# Altium schematic sheet [2] ADC.SchDoc: ADC
size 393 x 281 mm; SheetNumber: 2; SheetTotal: 21; PageSetup: Record=PageOptions|CenterHorizontal=True|CenterVertical=True|PrintScale=0.94|XCorrection=0.00|YCorrection=0.00|PrintKind=0|BorderSize=5000000|LeftOffset=0|BottomOffset=0|Orientation=2|PaperLength=1000|PaperWidth=1000|Scale=100|PaperSource=15|PrintQuality=600|MediaType=1|DitherType=10|PrintScaleMode=1|PaperKind=A4; Adr1: August Barks gata 6B; Adr2: SE-421 32 Västra Frölunda; Adr3: Sweden; Webpage: www.omnisys.se
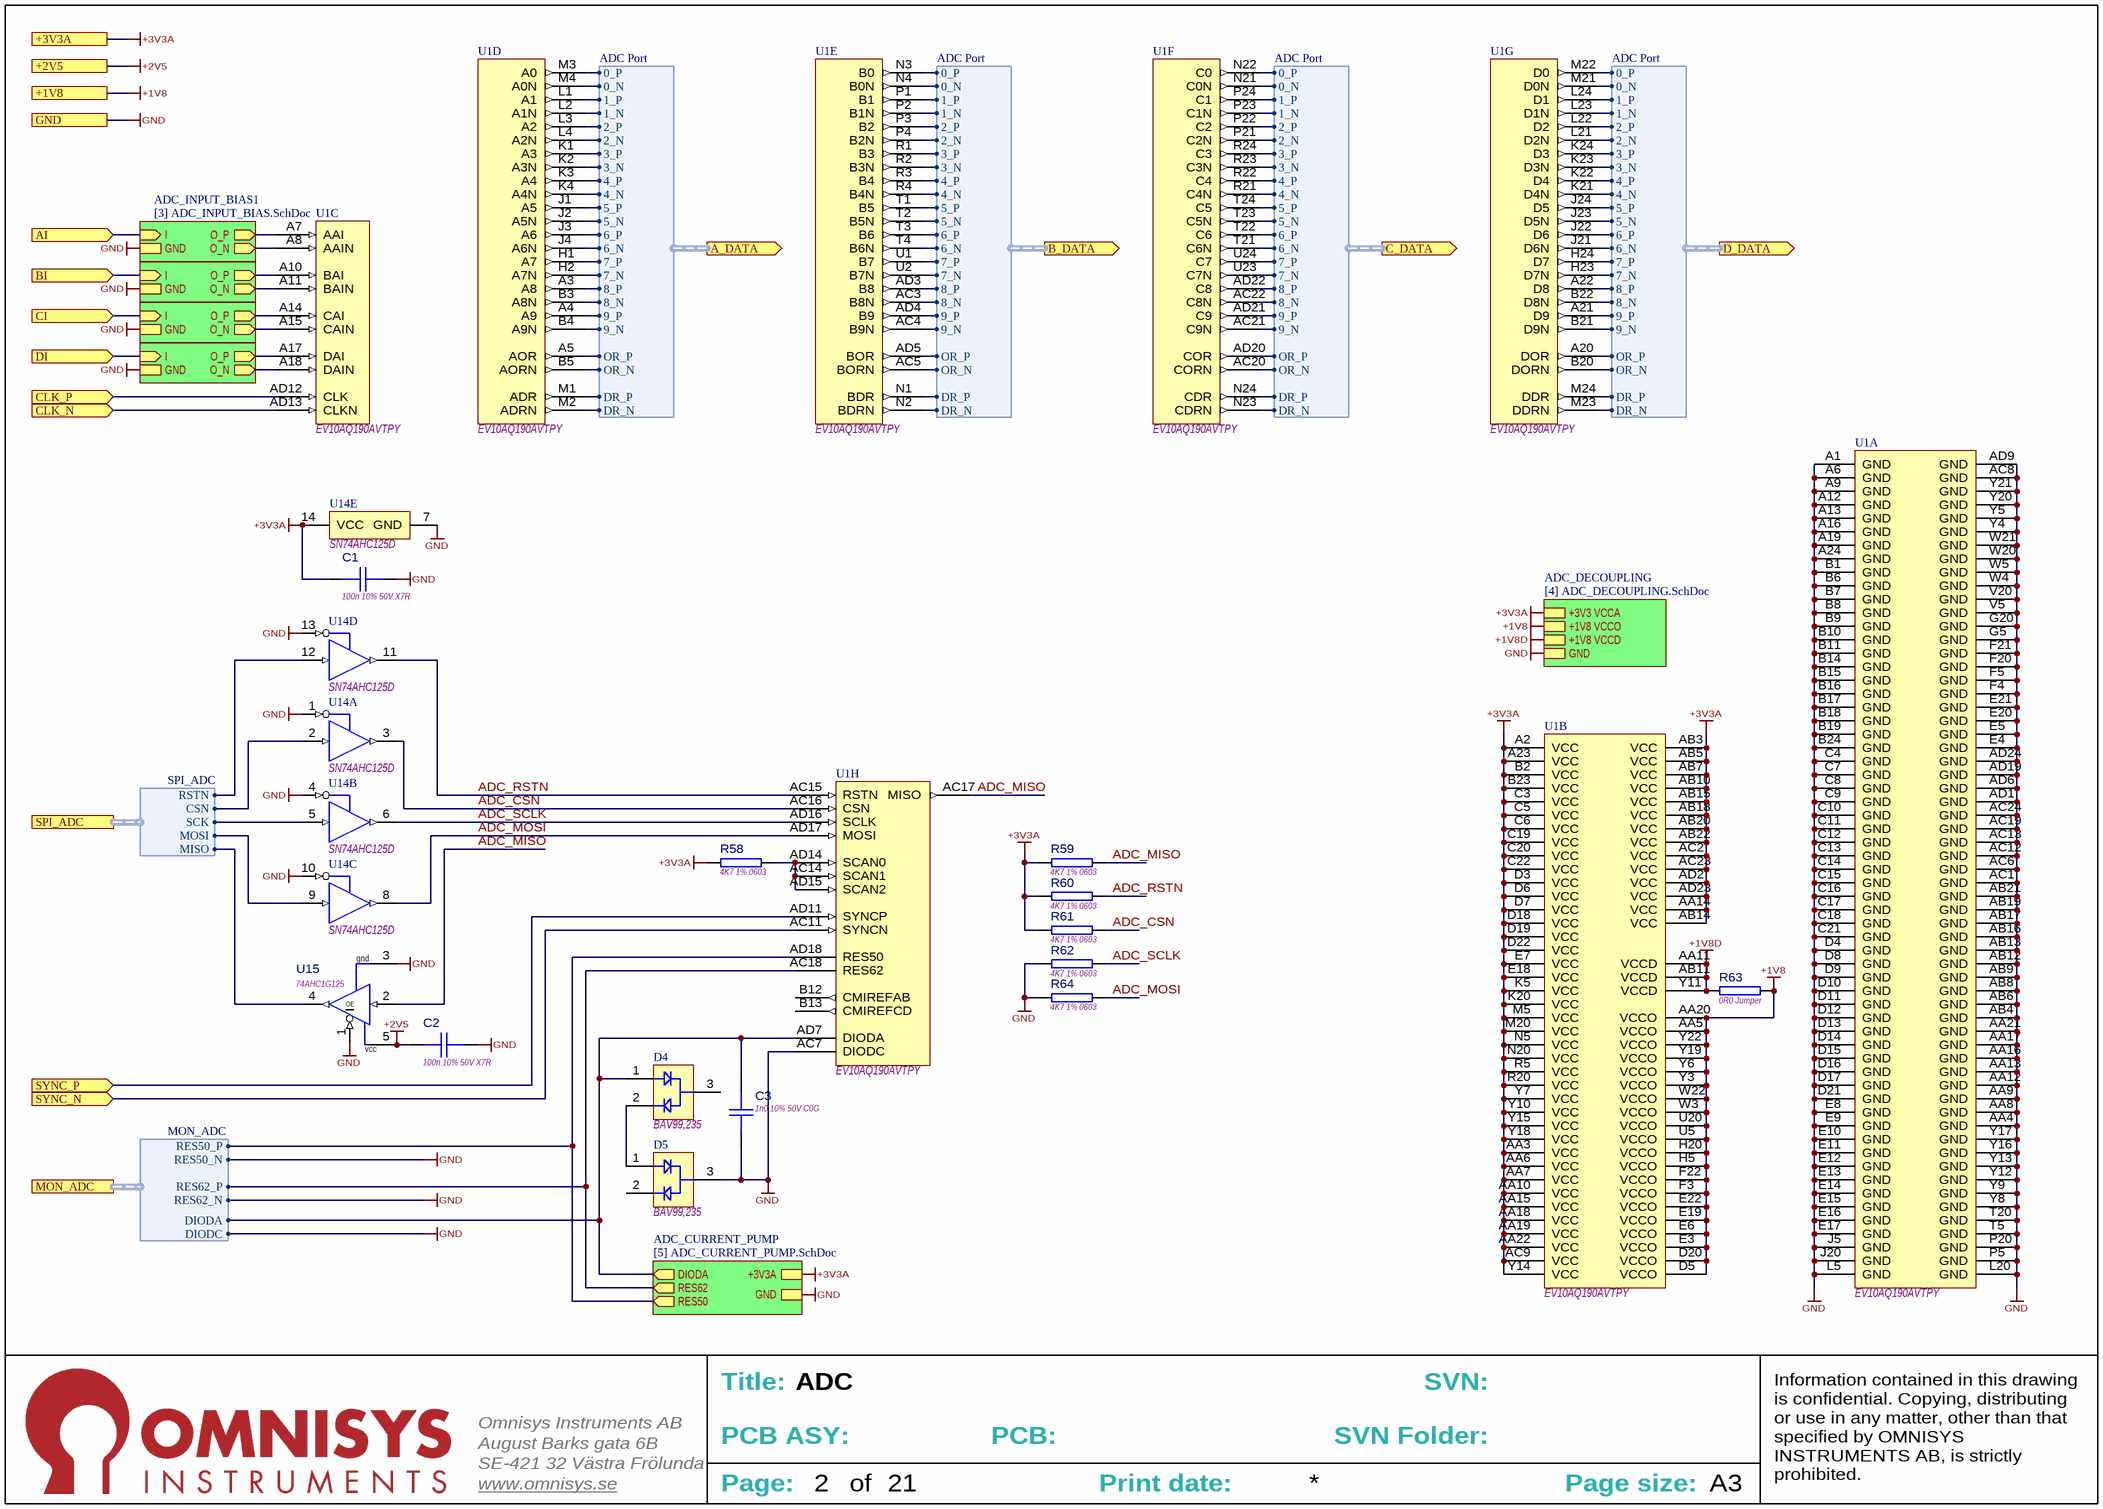
[diagram p0: [2] ADC.SchDoc]

## Parts
C1  100n 10% 50V X7R  [CAPC1608X90N]
C2  100n 10% 50V X7R  [CAPC1608X90N]
C3  1n0 10% 50V C0G  [CAPC1608X90N]
D4  BAV99,235  [SOT95P230X110-3N]
D5  BAV99,235  [SOT95P230X110-3N]
R58  4K7 1% 0603  [RESC1608N]
R59  4K7 1% 0603  [RESC1608N]
R60  4K7 1% 0603  [RESC1608N]
R61  4K7 1% 0603  [RESC1608N]
R62  4K7 1% 0603  [RESC1608N]
R63  0R0 Jumper  [RESC2012N]
R64  4K7 1% 0603  [RESC1608N]
U1  EV10AQ190AVTPY  [BGA380C127P24X24_3100X3100X160]  (parts A,B,C,D,E,F,G,H of 8)
U14  SN74AHC125D  [SOIC127P600X175-14N]  (parts A,B,C,D,E of 5)
U15  74AHC1G125  [SOT95P280X100-5N]

## Sub-sheets
ADC_CURRENT_PUMP = [5] ADC_CURRENT_PUMP.SchDoc: DIODA (out), RES50 (out), RES62 (out), GND, +3V3A
ADC_DECOUPLING = [4] ADC_DECOUPLING.SchDoc: +3V3 VCCA, +1V8 VCCO, +1V8 VCCD, GND
ADC_INPUT_BIAS1 = [3] ADC_INPUT_BIAS.SchDoc: I (in), O_P (out), O_N (out), GND
ADC_INPUT_BIAS2 = [3] ADC_INPUT_BIAS.SchDoc: I (in), O_P (out), O_N (out), GND
ADC_INPUT_BIAS3 = [3] ADC_INPUT_BIAS.SchDoc: I (in), O_P (out), O_N (out), GND
ADC_INPUT_BIAS4 = [3] ADC_INPUT_BIAS.SchDoc: I (in), O_P (out), O_N (out), GND

## Ports
+1V8, +2V5, +3V3A, A_DATA (out, harness ADC Port), AI (in), B_DATA (out, harness ADC Port), BI (in), C_DATA (out, harness ADC Port), CI (in), CLK_N (in), CLK_P (in), D_DATA (out, harness ADC Port), DI (in), GND, MON_ADC (harness MON_ADC), SPI_ADC (harness SPI_ADC), SYNC_N (in), SYNC_P (in)

## Harnesses
ADC Port: 0_P, 1_P, 2_P, 3_P, 4_P, 5_P, 6_P, 7_P, 8_P, 9_P, 0_N, 1_N, 2_N, 3_N, 4_N, 5_N, 6_N, 7_N, 8_N, 9_N, OR_P, OR_N, DR_P, DR_N
SPI_ADC: RSTN, CSN, SCK, MOSI, MISO
MON_ADC: DIODA, DIODC, RES50_P, RES50_N, RES62_P, RES62_N

## Nets
+1V8: R63.2 U1.AA5(VCCO) U1.AA20(VCCO) U1.D5(VCCO) U1.D20(VCCO) U1.E3(VCCO) U1.E6(VCCO) U1.E19(VCCO) U1.E22(VCCO) U1.F3(VCCO) U1.F22(VCCO) U1.H5(VCCO) U1.H20(VCCO) U1.U5(VCCO) U1.U20(VCCO) U1.W3(VCCO) U1.W22(VCCO) U1.Y3(VCCO) U1.Y6(VCCO) U1.Y19(VCCO) U1.Y22(VCCO) ; port +1V8, sheet ADC_DECOUPLING/+1V8 VCCO
+1V8D: R63.1 U1.AA11(VCCD) U1.AB11(VCCD) U1.Y11(VCCD) ; sheet ADC_DECOUPLING/+1V8 VCCD
+2V5: C2.1 U15.5(VCC) ; port +2V5
+3V3A: C1.1 R58.2 R59.2 R60.1 R61.1 U1.A2(VCC) U1.A23(VCC) U1.AA3(VCC) U1.AA6(VCC) U1.AA7(VCC) U1.AA10(VCC) U1.AA14(VCC) U1.AA15(VCC) U1.AA18(VCC) U1.AA19(VCC) U1.AA22(VCC) U1.AB3(VCC) U1.AB5(VCC) U1.AB7(VCC) U1.AB10(VCC) U1.AB14(VCC) U1.AB15(VCC) U1.AB18(VCC) U1.AB20(VCC) U1.AB22(VCC) U1.AC2(VCC) U1.AC9(VCC) U1.AC23(VCC) U1.AD2(VCC) U1.AD23(VCC) U1.B2(VCC) U1.B23(VCC) U1.C3(VCC) U1.C5(VCC) U1.C6(VCC) U1.C19(VCC) U1.C20(VCC) U1.C22(VCC) U1.D3(VCC) U1.D6(VCC) U1.D7(VCC) U1.D18(VCC) U1.D19(VCC) U1.D22(VCC) U1.E7(VCC) U1.E18(VCC) U1.K5(VCC) U1.K20(VCC) U1.M5(VCC) U1.M20(VCC) U1.N5(VCC) U1.N20(VCC) U1.R5(VCC) U1.R20(VCC) U1.Y7(VCC) U1.Y10(VCC) U1.Y14(VCC) U1.Y15(VCC) U1.Y18(VCC) U14.14(VCC) ; port +3V3A, sheet ADC_DECOUPLING/+3V3 VCCA, sheet ADC_CURRENT_PUMP/+3V3A
GND: C1.2 C2.2 C3.1 D5.3(C) R62.1 R64.1 U1.A1(GND) U1.A6(GND) U1.A9(GND) U1.A12(GND) U1.A13(GND) U1.A16(GND) U1.A19(GND) U1.A24(GND) U1.AA4(GND) U1.AA8(GND) U1.AA9(GND) U1.AA12(GND) U1.AA13(GND) U1.AA16(GND) U1.AA17(GND) U1.AA21(GND) U1.AB4(GND) U1.AB6(GND) U1.AB8(GND) U1.AB9(GND) U1.AB12(GND) U1.AB13(GND) U1.AB16(GND) U1.AB17(GND) U1.AB19(GND) U1.AB21(GND) U1.AC1(GND) U1.AC6(GND) U1.AC7(DIODC) U1.AC8(GND) U1.AC12(GND) U1.AC13(GND) U1.AC19(GND) U1.AC24(GND) U1.AD1(GND) U1.AD6(GND) U1.AD9(GND) U1.AD19(GND) U1.AD24(GND) U1.B1(GND) U1.B6(GND) U1.B7(GND) U1.B8(GND) U1.B9(GND) U1.B10(GND) U1.B11(GND) U1.B14(GND) U1.B15(GND) U1.B16(GND) U1.B17(GND) U1.B18(GND) U1.B19(GND) U1.B24(GND) U1.C4(GND) U1.C7(GND) U1.C8(GND) U1.C9(GND) U1.C10(GND) U1.C11(GND) U1.C12(GND) U1.C13(GND) U1.C14(GND) U1.C15(GND) U1.C16(GND) U1.C17(GND) U1.C18(GND) U1.C21(GND) U1.D4(GND) U1.D8(GND) U1.D9(GND) U1.D10(GND) U1.D11(GND) U1.D12(GND) U1.D13(GND) U1.D14(GND) U1.D15(GND) U1.D16(GND) U1.D17(GND) U1.D21(GND) U1.E4(GND) U1.E5(GND) U1.E8(GND) U1.E9(GND) U1.E10(GND) U1.E11(GND) U1.E12(GND) U1.E13(GND) U1.E14(GND) U1.E15(GND) U1.E16(GND) U1.E17(GND) U1.E20(GND) U1.E21(GND) U1.F4(GND) U1.F5(GND) U1.F20(GND) U1.F21(GND) U1.G5(GND) U1.G20(GND) U1.J5(GND) U1.J20(GND) U1.L5(GND) U1.L20(GND) U1.P5(GND) U1.P20(GND) U1.T5(GND) U1.T20(GND) U1.V5(GND) U1.V20(GND) U1.W4(GND) U1.W5(GND) U1.W20(GND) U1.W21(GND) U1.Y4(GND) U1.Y5(GND) U1.Y8(GND) U1.Y9(GND) U1.Y12(GND) U1.Y13(GND) U1.Y16(GND) U1.Y17(GND) U1.Y20(GND) U1.Y21(GND) U14.1(1OE#) U14.4(2OE#) U14.7(GND) U14.10(3OE#) U14.13(4OE#) U15.1(~{O}E) U15.3(GND) ; port GND, sheet ADC_DECOUPLING/GND, sheet ADC_INPUT_BIAS1/GND, sheet ADC_INPUT_BIAS4/GND, sheet ADC_INPUT_BIAS3/GND, sheet ADC_INPUT_BIAS2/GND, sheet ADC_CURRENT_PUMP/GND, port MON_ADC.DIODC, port MON_ADC.RES50_N, port MON_ADC.RES62_N
ADC_CSN: R61.2 U1.AC16(CSN) U14.3(1Y)
ADC_MISO: R59.1 U1.AC17(MISO) U15.2(B)
ADC_MOSI: R64.2 U1.AD17(MOSI) U14.8(3Y)
ADC_RSTN: R60.2 U1.AC15(RSTN) U14.11(4Y)
ADC_SCLK: R62.2 U1.AD16(SCLK) U14.6(2Y)
AI: port AI, sheet ADC_INPUT_BIAS1/I
BI: port BI, sheet ADC_INPUT_BIAS4/I
CI: port CI, sheet ADC_INPUT_BIAS3/I
CLK_N: U1.AD13(CLKN) ; port CLK_N
CLK_P: U1.AD12(CLK) ; port CLK_P
DI: port DI, sheet ADC_INPUT_BIAS2/I
SYNC_N: U1.AC11(SYNCN) ; port SYNC_N
SYNC_P: U1.AD11(SYNCP) ; port SYNC_P
NetC3_2: C3.2 D4.1(A1) U1.AD7(DIODA) ; sheet ADC_CURRENT_PUMP/DIODA, port MON_ADC.DIODA
NetD4_2: D4.2(K2) D5.1(A1)
NetR58_1: R58.1 U1.AC14(SCAN1) U1.AD14(SCAN0) U1.AD15(SCAN2)
NetU1_A3: U1.A3(A8) ; port A_DATA.8_P
NetU1_A4: U1.A4(A9) ; port A_DATA.9_P
NetU1_A5: U1.A5(AOR) ; port A_DATA.OR_P
NetU1_A7: U1.A7(AAI) ; sheet ADC_INPUT_BIAS1/O_P
NetU1_A8: U1.A8(AAIN) ; sheet ADC_INPUT_BIAS1/O_N
NetU1_A10: U1.A10(BAI) ; sheet ADC_INPUT_BIAS4/O_P
NetU1_A11: U1.A11(BAIN) ; sheet ADC_INPUT_BIAS4/O_N
NetU1_A14: U1.A14(CAI) ; sheet ADC_INPUT_BIAS3/O_P
NetU1_A15: U1.A15(CAIN) ; sheet ADC_INPUT_BIAS3/O_N
NetU1_A17: U1.A17(DAI) ; sheet ADC_INPUT_BIAS2/O_P
NetU1_A18: U1.A18(DAIN) ; sheet ADC_INPUT_BIAS2/O_N
NetU1_A20: U1.A20(DOR) ; port D_DATA.OR_P
NetU1_A21: U1.A21(D9) ; port D_DATA.9_P
NetU1_A22: U1.A22(D8) ; port D_DATA.8_P
NetU1_AC3: U1.AC3(B8N) ; port B_DATA.8_N
NetU1_AC4: U1.AC4(B9N) ; port B_DATA.9_N
NetU1_AC5: U1.AC5(BORN) ; port B_DATA.OR_N
NetU1_AC18: U1.AC18(RES62) ; sheet ADC_CURRENT_PUMP/RES62, port MON_ADC.RES62_P
NetU1_AC20: U1.AC20(CORN) ; port C_DATA.OR_N
NetU1_AC21: U1.AC21(C9N) ; port C_DATA.9_N
NetU1_AC22: U1.AC22(C8N) ; port C_DATA.8_N
NetU1_AD3: U1.AD3(B8) ; port B_DATA.8_P
NetU1_AD4: U1.AD4(B9) ; port B_DATA.9_P
NetU1_AD5: U1.AD5(BOR) ; port B_DATA.OR_P
NetU1_AD18: U1.AD18(RES50) ; sheet ADC_CURRENT_PUMP/RES50, port MON_ADC.RES50_P
NetU1_AD20: U1.AD20(COR) ; port C_DATA.OR_P
NetU1_AD21: U1.AD21(C9) ; port C_DATA.9_P
NetU1_AD22: U1.AD22(C8) ; port C_DATA.8_P
NetU1_B3: U1.B3(A8N) ; port A_DATA.8_N
NetU1_B4: U1.B4(A9N) ; port A_DATA.9_N
NetU1_B5: U1.B5(AORN) ; port A_DATA.OR_N
NetU1_B20: U1.B20(DORN) ; port D_DATA.OR_N
NetU1_B21: U1.B21(D9N) ; port D_DATA.9_N
NetU1_B22: U1.B22(D8N) ; port D_DATA.8_N
NetU1_H1: U1.H1(A7) ; port A_DATA.7_P
NetU1_H2: U1.H2(A7N) ; port A_DATA.7_N
NetU1_H23: U1.H23(D7N) ; port D_DATA.7_N
NetU1_H24: U1.H24(D7) ; port D_DATA.7_P
NetU1_J1: U1.J1(A5) ; port A_DATA.5_P
NetU1_J2: U1.J2(A5N) ; port A_DATA.5_N
NetU1_J3: U1.J3(A6) ; port A_DATA.6_P
NetU1_J4: U1.J4(A6N) ; port A_DATA.6_N
NetU1_J21: U1.J21(D6N) ; port D_DATA.6_N
NetU1_J22: U1.J22(D6) ; port D_DATA.6_P
NetU1_J23: U1.J23(D5N) ; port D_DATA.5_N
NetU1_J24: U1.J24(D5) ; port D_DATA.5_P
NetU1_K1: U1.K1(A3) ; port A_DATA.3_P
NetU1_K2: U1.K2(A3N) ; port A_DATA.3_N
NetU1_K3: U1.K3(A4) ; port A_DATA.4_P
NetU1_K4: U1.K4(A4N) ; port A_DATA.4_N
NetU1_K21: U1.K21(D4N) ; port D_DATA.4_N
NetU1_K22: U1.K22(D4) ; port D_DATA.4_P
NetU1_K23: U1.K23(D3N) ; port D_DATA.3_N
NetU1_K24: U1.K24(D3) ; port D_DATA.3_P
NetU1_L1: U1.L1(A1) ; port A_DATA.1_P
NetU1_L2: U1.L2(A1N) ; port A_DATA.1_N
NetU1_L3: U1.L3(A2) ; port A_DATA.2_P
NetU1_L4: U1.L4(A2N) ; port A_DATA.2_N
NetU1_L21: U1.L21(D2N) ; port D_DATA.2_N
NetU1_L22: U1.L22(D2) ; port D_DATA.2_P
NetU1_L23: U1.L23(D1N) ; port D_DATA.1_N
NetU1_L24: U1.L24(D1) ; port D_DATA.1_P
NetU1_M1: U1.M1(ADR) ; port A_DATA.DR_P
NetU1_M2: U1.M2(ADRN) ; port A_DATA.DR_N
NetU1_M3: U1.M3(A0) ; port A_DATA.0_P
NetU1_M4: U1.M4(A0N) ; port A_DATA.0_N
NetU1_M21: U1.M21(D0N) ; port D_DATA.0_N
NetU1_M22: U1.M22(D0) ; port D_DATA.0_P
NetU1_M23: U1.M23(DDRN) ; port D_DATA.DR_N
NetU1_M24: U1.M24(DDR) ; port D_DATA.DR_P
NetU1_N1: U1.N1(BDR) ; port B_DATA.DR_P
NetU1_N2: U1.N2(BDRN) ; port B_DATA.DR_N
NetU1_N3: U1.N3(B0) ; port B_DATA.0_P
NetU1_N4: U1.N4(B0N) ; port B_DATA.0_N
NetU1_N21: U1.N21(C0N) ; port C_DATA.0_N
NetU1_N22: U1.N22(C0) ; port C_DATA.0_P
NetU1_N23: U1.N23(CDRN) ; port C_DATA.DR_N
NetU1_N24: U1.N24(CDR) ; port C_DATA.DR_P
NetU1_P1: U1.P1(B1) ; port B_DATA.1_P
NetU1_P2: U1.P2(B1N) ; port B_DATA.1_N
NetU1_P3: U1.P3(B2) ; port B_DATA.2_P
NetU1_P4: U1.P4(B2N) ; port B_DATA.2_N
NetU1_P21: U1.P21(C2N) ; port C_DATA.2_N
NetU1_P22: U1.P22(C2) ; port C_DATA.2_P
NetU1_P23: U1.P23(C1N) ; port C_DATA.1_N
NetU1_P24: U1.P24(C1) ; port C_DATA.1_P
NetU1_R1: U1.R1(B3) ; port B_DATA.3_P
NetU1_R2: U1.R2(B3N) ; port B_DATA.3_N
NetU1_R3: U1.R3(B4) ; port B_DATA.4_P
NetU1_R4: U1.R4(B4N) ; port B_DATA.4_N
NetU1_R21: U1.R21(C4N) ; port C_DATA.4_N
NetU1_R22: U1.R22(C4) ; port C_DATA.4_P
NetU1_R23: U1.R23(C3N) ; port C_DATA.3_N
NetU1_R24: U1.R24(C3) ; port C_DATA.3_P
NetU1_T1: U1.T1(B5) ; port B_DATA.5_P
NetU1_T2: U1.T2(B5N) ; port B_DATA.5_N
NetU1_T3: U1.T3(B6) ; port B_DATA.6_P
NetU1_T4: U1.T4(B6N) ; port B_DATA.6_N
NetU1_T21: U1.T21(C6N) ; port C_DATA.6_N
NetU1_T22: U1.T22(C6) ; port C_DATA.6_P
NetU1_T23: U1.T23(C5N) ; port C_DATA.5_N
NetU1_T24: U1.T24(C5) ; port C_DATA.5_P
NetU1_U1: U1.U1(B7) ; port B_DATA.7_P
NetU1_U2: U1.U2(B7N) ; port B_DATA.7_N
NetU1_U23: U1.U23(C7N) ; port C_DATA.7_N
NetU1_U24: U1.U24(C7) ; port C_DATA.7_P
NetU14_2: U14.2(1A) ; port SPI_ADC.CSN
NetU14_5: U14.5(2A) ; port SPI_ADC.SCK
NetU14_9: U14.9(3A) ; port SPI_ADC.MOSI
NetU14_12: U14.12(4A) ; port SPI_ADC.RSTN
NetU15_4: U15.4(Y) ; port SPI_ADC.MISO

Not connected (* = marked no-connect by the designer): D4 3(C); D5 2(K2); U1 B12(CMIREFAB) B13(CMIREFCD)

## Notes on the sheet
- Title:
- SVN:
- August Barks gata 6B
- SE-421 32 Västra Frölunda
- Omnisys Instruments AB
- PCB ASY:
- PCB:
- SVN Folder:
- www.omnisys.se
- Page:
- of
- Print date:
- Page size:
- A3
- Information contained in this drawing is confidential. Copying, distributing or use in any matter, other than that specified by OMNISYS INSTRUMENTS AB, is strictly prohibited.
- (in symbol CMP-2100-000126-2) gnd; OE; vcc

## Library data of the parts
C1 C2 = CMP-0300-002665-6: Ceramic Chip Capacitor, 0603/1608; Capacitance: 100nF; Package: 1608/0603; Temperature Charateristics: X7R; Tolerance: 10%; Rated Voltage: 50V; Thickness: 900µm; Weight: 9mg
C3 = CMP-0300-002463-5: Ceramic Chip Capacitor, 0603/1608; Tolerance: 5%; Capacitance: 1nF; Package: 1608/0603; Temperature Charateristics: C0G; Rated Voltage: 50V; Thickness: 900µm; Weight: 9mg
D4 D5 = CMP-0400-000272-1: BAV99 Series 100 V 215 mA SMT High Speed Switching Diode - SOT-23; Forward Current: 215mA; Max Reverse Voltage (DC): 100V; Voltage: 75V; Max Reverse Leakage Current: 500nA; Forward Voltage: 1.25V; Max Surge Current: 4A; Reverse Recovery Time: 4ns; Package Quantity: 1; Lead Free: Lead Free; Average Rectified Current: 215mA; Max Repetitive Reverse Voltage (Vrrm): 100V; Mount: Surface Mount; Max Operating Temperature: 150°C; REACH SVHC: No SVHC; Case/Package: TO-236-3; Number of Pins: 3; Peak Non-Repetitive Surge Current: 4A; Max Forward Surge Current (Ifsm): 4A; Min Operating Temperature: -65°C; Radiation Hardening: No; Packaging: Tape and Reel; Recovery Time: 4ns
R58-R62 R64 = CMP-1800-002037-5: Thick film Chip Resistor, 0603/1608; Value: 4.7k; Power: 100mW; Maximum working voltage: 75V; Temp. Coefficent: 0.01%; Tolerance: 1%; Case/Package: 0603/1608; Composition: Thick film
R63 = CMP-1800-000000-5: Thick film Chip Resistor, 0805/2012; Value: 0; Power: 0W; Maximum working voltage: 150V; Tolerance: 0%; Temp. Coefficent: 0%; Case/Package: 0805/2012; Composition: Thick film
U1 = CMP-2100-000558-3: Quad ADC 1.25Gsps 10-bit Parallel/LVDS 380-Pin EBGA; Resolution: 10b; Sampling Rate: 1.25GS/s; Number of A/D Converters: 4; Number of Analog Inputs: 1; PartNumber: EV10AQ190AVTPY; Mount: Surface Mount; Number of Pins: 380
U14 = CMP-2100-000562-3: Buffer/Line Driver 4-CH Non-Inverting 3-ST CMOS 14-Pin SOIC Tube; Number of Bits: 4; Min Supply Voltage: 2V; Propagation Delay: 15ns; High Level Output Current: -8mA; Quiescent Current: 4uA; Number of Bits per Element: 1; Max Supply Voltage: 5.5V; Logic Function: Buffer,Inverting; Turn-On Delay Time: 11.5ns; Low Level Output Current: 8mA; REACH SVHC: No SVHC; Max Operating Temperature: 125°C; Polarity: Non-Inverting; Case/Package: SOIC; Number of Elements: 4; Package Quantity: 50; Number of Output Lines: 4; Min Operating Temperature: -40°C; Length: 8.65mm; Mount: Surface Mount; Number of Channels: 4; Number of Pins: 14; Termination: SMD/SMT; Number of Inputs: 4; Radiation Hardening: No; Lead Free: Lead Free; Height: 1.58mm; Number of Input Lines: 4; Packaging: Rail/Tube; Width: 3.91mm; Number of Outputs: 4
U15 = CMP-2100-000126-2: Single bus buffer gate with 3-state output